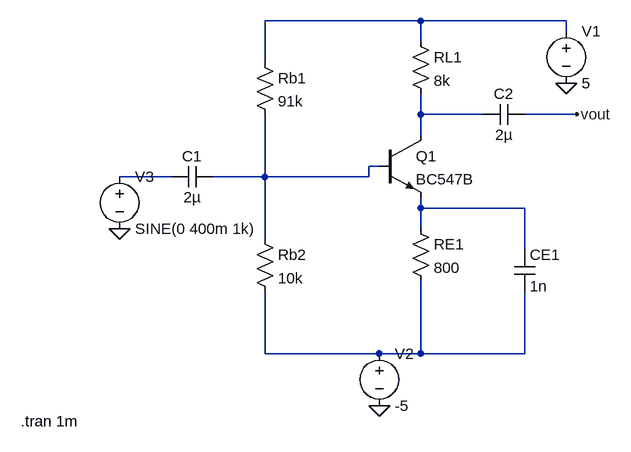
[diagram p0: schematic gain-stage.asc]
gain-stage.asc, the LTspice schematic file:
Version 4
SHEET 1 880 680
WIRE 192 -128 -48 -128
WIRE 416 -128 192 -128
WIRE 416 -112 416 -128
WIRE 192 -96 192 -128
WIRE -48 -64 -48 -128
WIRE 192 16 192 -16
WIRE 288 16 192 16
WIRE 432 16 352 16
WIRE 192 48 192 16
WIRE 128 96 112 96
WIRE -192 112 -272 112
WIRE -48 112 -48 16
WIRE -48 112 -128 112
WIRE 112 112 112 96
WIRE 112 112 -48 112
WIRE 192 160 192 144
WIRE 352 160 192 160
WIRE 192 192 192 160
WIRE -48 208 -48 112
WIRE 352 224 352 160
WIRE -48 384 -48 288
WIRE 128 384 -48 384
WIRE 192 384 192 272
WIRE 192 384 128 384
WIRE 352 384 352 288
WIRE 352 384 192 384
FLAG 416 -32 0
FLAG 128 464 0
FLAG 432 16 vout
FLAG -272 192 0
SYMBOL cap -128 96 R90
WINDOW 0 0 32 VBottom 2
WINDOW 3 32 32 VTop 2
SYMATTR InstName C1
SYMATTR Value 2µ
SYMBOL res -64 -80 R0
SYMATTR InstName Rb1
SYMATTR Value 91k
SYMBOL res -64 192 R0
SYMATTR InstName Rb2
SYMATTR Value 10k
SYMBOL voltage 416 -128 R0
SYMATTR InstName V1
SYMATTR Value 5
SYMBOL res 176 -112 R0
SYMATTR InstName RL1
SYMATTR Value 8k
SYMBOL npn 128 48 R0
SYMATTR InstName Q1
SYMATTR Value BC547B
SYMBOL res 176 176 R0
SYMATTR InstName RE1
SYMATTR Value 800
SYMBOL cap 336 224 R0
SYMATTR InstName CE1
SYMATTR Value 1n
SYMBOL voltage 128 368 R0
SYMATTR InstName V2
SYMATTR Value -5
SYMBOL cap 352 0 R90
WINDOW 0 0 32 VBottom 2
WINDOW 3 32 32 VTop 2
SYMATTR InstName C2
SYMATTR Value 2µ
SYMBOL voltage -272 96 R0
WINDOW 123 0 0 Left 0
WINDOW 39 0 0 Left 0
SYMATTR InstName V3
SYMATTR Value SINE(0 400m 1k)
TEXT -424 488 Left 2 !.tran 1m

The netlist it stands for:
* gain-stage.asc
C1 N003 N004 2µ
Rb1 N001 N003 91k
Rb2 N003 N006 10k
V1 N001 0 5
RL1 N001 N002 8k
Q1 N002 N003 N005 0 BC547B
RE1 N005 N006 800
CE1 N005 N006 1n
V2 N006 0 -5
C2 vout N002 2µ
V3 N004 0 SINE(0 400m 1k)
.model NPN NPN
.model PNP PNP
.lib standard.bjt
.tran 1m
.backanno
.end